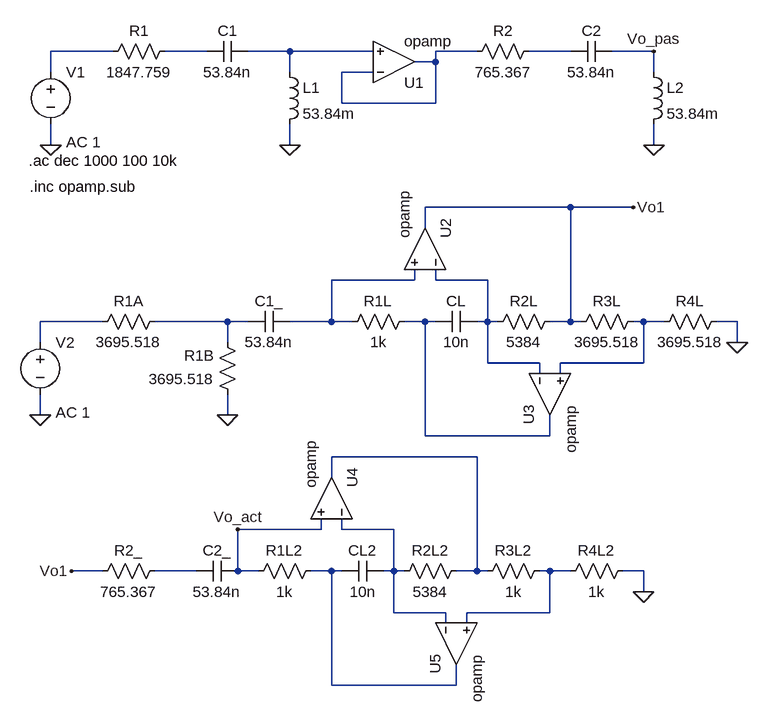
[diagram p0: schematic Ej4.asc]
Ej4.asc, the LTspice schematic file:
Version 4
SHEET 1 2176 1092
WIRE 96 112 0 112
WIRE 240 112 176 112
WIRE 368 112 304 112
WIRE 496 112 368 112
WIRE 656 112 592 112
WIRE 800 112 736 112
WIRE 928 112 864 112
WIRE 592 128 592 112
WIRE 592 128 560 128
WIRE 0 144 0 112
WIRE 368 144 368 112
WIRE 496 144 448 144
WIRE 928 144 928 112
WIRE 448 192 448 144
WIRE 592 192 592 128
WIRE 592 192 448 192
WIRE 0 256 0 224
WIRE 368 256 368 224
WIRE 928 256 928 224
WIRE 800 352 576 352
WIRE 896 352 800 352
WIRE 576 384 576 352
WIRE 560 464 560 448
WIRE 560 464 432 464
WIRE 592 464 592 448
WIRE 672 464 592 464
WIRE 80 528 -16 528
WIRE 272 528 160 528
WIRE 304 528 272 528
WIRE 432 528 432 464
WIRE 432 528 368 528
WIRE 464 528 432 528
WIRE 576 528 544 528
WIRE 592 528 576 528
WIRE 672 528 672 464
WIRE 672 528 656 528
WIRE 688 528 672 528
WIRE 800 528 800 352
WIRE 800 528 768 528
WIRE 816 528 800 528
WIRE 912 528 896 528
WIRE 944 528 912 528
WIRE 1056 528 1024 528
WIRE -16 560 -16 528
WIRE 272 560 272 528
WIRE 1056 560 1056 528
WIRE 672 592 672 528
WIRE 752 592 672 592
WIRE 912 592 912 528
WIRE 912 592 784 592
WIRE 752 608 752 592
WIRE 784 608 784 592
WIRE -16 672 -16 640
WIRE 272 672 272 640
WIRE 576 704 576 528
WIRE 768 704 768 672
WIRE 768 704 576 704
WIRE 656 736 432 736
WIRE 432 768 432 736
WIRE 416 848 416 832
WIRE 416 848 288 848
WIRE 448 848 448 832
WIRE 528 848 448 848
WIRE 80 912 32 912
WIRE 224 912 160 912
WIRE 288 912 288 848
WIRE 320 912 288 912
WIRE 432 912 400 912
WIRE 448 912 432 912
WIRE 528 912 528 848
WIRE 528 912 512 912
WIRE 544 912 528 912
WIRE 656 912 656 736
WIRE 656 912 624 912
WIRE 672 912 656 912
WIRE 768 912 752 912
WIRE 800 912 768 912
WIRE 912 912 880 912
WIRE 912 944 912 912
WIRE 528 976 528 912
WIRE 608 976 528 976
WIRE 768 976 768 912
WIRE 768 976 640 976
WIRE 608 992 608 976
WIRE 640 992 640 976
WIRE 432 1088 432 912
WIRE 624 1088 624 1056
WIRE 624 1088 432 1088
FLAG 0 256 0
FLAG 368 256 0
FLAG 928 256 0
FLAG -16 672 0
FLAG 1056 560 0
FLAG 896 352 Vo1
FLAG 272 672 0
FLAG 32 912 Vo1
FLAG 912 944 0
FLAG 288 848 Vo_act
FLAG 928 112 Vo_pas
SYMBOL voltage 0 128 R0
WINDOW 123 24 124 Left 2
WINDOW 39 0 0 Left 0
SYMATTR InstName V1
SYMATTR Value ""
SYMATTR Value2 AC 1
SYMBOL res 192 96 R90
WINDOW 0 0 56 VBottom 2
WINDOW 3 32 56 VTop 2
SYMATTR InstName R1
SYMATTR Value 1847.759
SYMBOL cap 240 96 M90
WINDOW 0 0 32 VBottom 2
WINDOW 3 32 32 VTop 2
SYMATTR InstName C1
SYMATTR Value 53.84n
SYMBOL ind 352 128 R0
SYMATTR InstName L1
SYMATTR Value 53.84m
SYMBOL OpAmps\\opamp 528 192 M180
SYMATTR InstName U1
SYMATTR SpiceLine Aol=1000Meg
SYMATTR SpiceLine2 GBW=1000Meg
SYMBOL res 752 96 R90
WINDOW 0 0 56 VBottom 2
WINDOW 3 32 56 VTop 2
SYMATTR InstName R2
SYMATTR Value 765.367
SYMBOL cap 800 96 M90
WINDOW 0 0 32 VBottom 2
WINDOW 3 32 32 VTop 2
SYMATTR InstName C2
SYMATTR Value 53.84n
SYMBOL ind 912 128 R0
SYMATTR InstName L2
SYMATTR Value 53.84m
SYMBOL voltage -16 544 R0
WINDOW 123 24 124 Left 2
WINDOW 39 0 0 Left 0
SYMATTR InstName V2
SYMATTR Value ""
SYMATTR Value2 AC 1
SYMBOL cap 304 512 M90
WINDOW 0 0 32 VBottom 2
WINDOW 3 32 32 VTop 2
SYMATTR InstName C1_
SYMATTR Value 53.84n
SYMBOL res 560 512 R90
WINDOW 0 0 56 VBottom 2
WINDOW 3 32 56 VTop 2
SYMATTR InstName R1L
SYMATTR Value 1k
SYMBOL cap 656 512 R90
WINDOW 0 0 32 VBottom 2
WINDOW 3 32 32 VTop 2
SYMATTR InstName CL
SYMATTR Value 10n
SYMBOL res 784 512 R90
WINDOW 0 0 56 VBottom 2
WINDOW 3 32 56 VTop 2
SYMATTR InstName R2L
SYMATTR Value 5384
SYMBOL res 912 512 R90
WINDOW 0 0 56 VBottom 2
WINDOW 3 32 56 VTop 2
SYMATTR InstName R3L
SYMATTR Value 3695.518
SYMBOL res 1040 512 R90
WINDOW 0 0 56 VBottom 2
WINDOW 3 32 56 VTop 2
SYMATTR InstName R4L
SYMATTR Value 3695.518
SYMBOL OpAmps\\opamp 640 416 M270
SYMATTR InstName U2
SYMATTR SpiceLine Aol=1000Meg
SYMATTR SpiceLine2 GBW=1000Meg
SYMBOL OpAmps\\opamp 704 640 M90
SYMATTR InstName U3
SYMATTR SpiceLine Aol=1000Meg
SYMATTR SpiceLine2 GBW=1000Meg
SYMBOL res 176 512 R90
WINDOW 0 0 56 VBottom 2
WINDOW 3 32 56 VTop 2
SYMATTR InstName R1A
SYMATTR Value 3695.518
SYMBOL res 288 656 R180
WINDOW 0 36 76 Left 2
WINDOW 3 36 40 Left 2
SYMATTR InstName R1B
SYMATTR Value 3695.518
SYMBOL res 176 896 R90
WINDOW 0 0 56 VBottom 2
WINDOW 3 32 56 VTop 2
SYMATTR InstName R2_
SYMATTR Value 765.367
SYMBOL cap 224 896 M90
WINDOW 0 0 32 VBottom 2
WINDOW 3 32 32 VTop 2
SYMATTR InstName C2_
SYMATTR Value 53.84n
SYMBOL res 416 896 R90
WINDOW 0 0 56 VBottom 2
WINDOW 3 32 56 VTop 2
SYMATTR InstName R1L2
SYMATTR Value 1k
SYMBOL cap 512 896 R90
WINDOW 0 0 32 VBottom 2
WINDOW 3 32 32 VTop 2
SYMATTR InstName CL2
SYMATTR Value 10n
SYMBOL res 640 896 R90
WINDOW 0 0 56 VBottom 2
WINDOW 3 32 56 VTop 2
SYMATTR InstName R2L2
SYMATTR Value 5384
SYMBOL res 768 896 R90
WINDOW 0 0 56 VBottom 2
WINDOW 3 32 56 VTop 2
SYMATTR InstName R3L2
SYMATTR Value 1k
SYMBOL res 896 896 R90
WINDOW 0 0 56 VBottom 2
WINDOW 3 32 56 VTop 2
SYMATTR InstName R4L2
SYMATTR Value 1k
SYMBOL OpAmps\\opamp 496 800 M270
SYMATTR InstName U4
SYMATTR SpiceLine Aol=1000Meg
SYMATTR SpiceLine2 GBW=1000Meg
SYMBOL OpAmps\\opamp 560 1024 M90
SYMATTR InstName U5
SYMATTR SpiceLine Aol=1000Meg
SYMATTR SpiceLine2 GBW=1000Meg
TEXT -34 280 Left 2 !.ac dec 1000 100 10k
TEXT -32 320 Left 2 !.inc opamp.sub

The netlist it stands for:
* Ej4.asc
V1 N001 0 AC 1
R1 N002 N001 1847.759
C1 N002 N003 53.84n
L1 N003 0 53.84m
XU1 N004 N003 N004 opamp Aol=1000Meg GBW=1000Meg  ; pins invin noninvin out
R2 N005 N004 765.367
C2 N005 Vo_pas 53.84n
L2 Vo_pas 0 53.84m
V2 N008 0 AC 1
C1_ N009 N006 53.84n
R1L N010 N006 1k
CL N007 N010 10n
R2L Vo1 N007 5384
R3L N011 Vo1 3695.518
R4L 0 N011 3695.518
XU2 N007 N006 Vo1 opamp Aol=1000Meg GBW=1000Meg  ; pins invin noninvin out
XU3 N007 N011 N010 opamp Aol=1000Meg GBW=1000Meg  ; pins invin noninvin out
R1A N009 N008 3695.518
R1B 0 N009 3695.518
R2_ N014 Vo1 765.367
C2_ N014 Vo_act 53.84n
R1L2 N015 Vo_act 1k
CL2 N013 N015 10n
R2L2 N012 N013 5384
R3L2 N016 N012 1k
R4L2 0 N016 1k
XU4 N013 Vo_act N012 opamp Aol=1000Meg GBW=1000Meg  ; pins invin noninvin out
XU5 N013 N016 N015 opamp Aol=1000Meg GBW=1000Meg  ; pins invin noninvin out
.ac dec 1000 100 10k
.inc opamp.sub
.backanno
.end

* Results of the author's LTspice run, read from the files saved beside the schematic
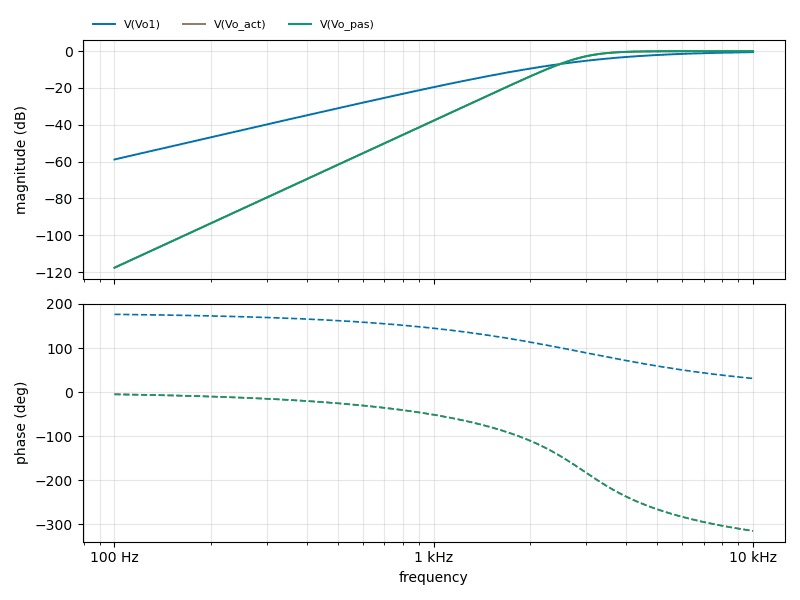
[diagram p1: AC Analysis of Ej4.asc, plotted from the saved traces]
* AC Analysis, 1 run:
*   V(Vo1): -58.84 dB at 100 Hz, -0.54 dB at 10 kHz, peak -0.54 dB at 10 kHz, 3 dB below the peak at 3.753 kHz
*   V(Vo_act): -117.66 dB at 100 Hz, -0.00 dB at 10 kHz, peak -0.00 dB at 10 kHz, 3 dB below the peak at 2.956 kHz
*   V(Vo_pas): -117.66 dB at 100 Hz, -0.00 dB at 10 kHz, peak -0.00 dB at 10 kHz, 3 dB below the peak at 2.956 kHz